# Altium schematic sheet LiPo_charger.SchDoc
size A
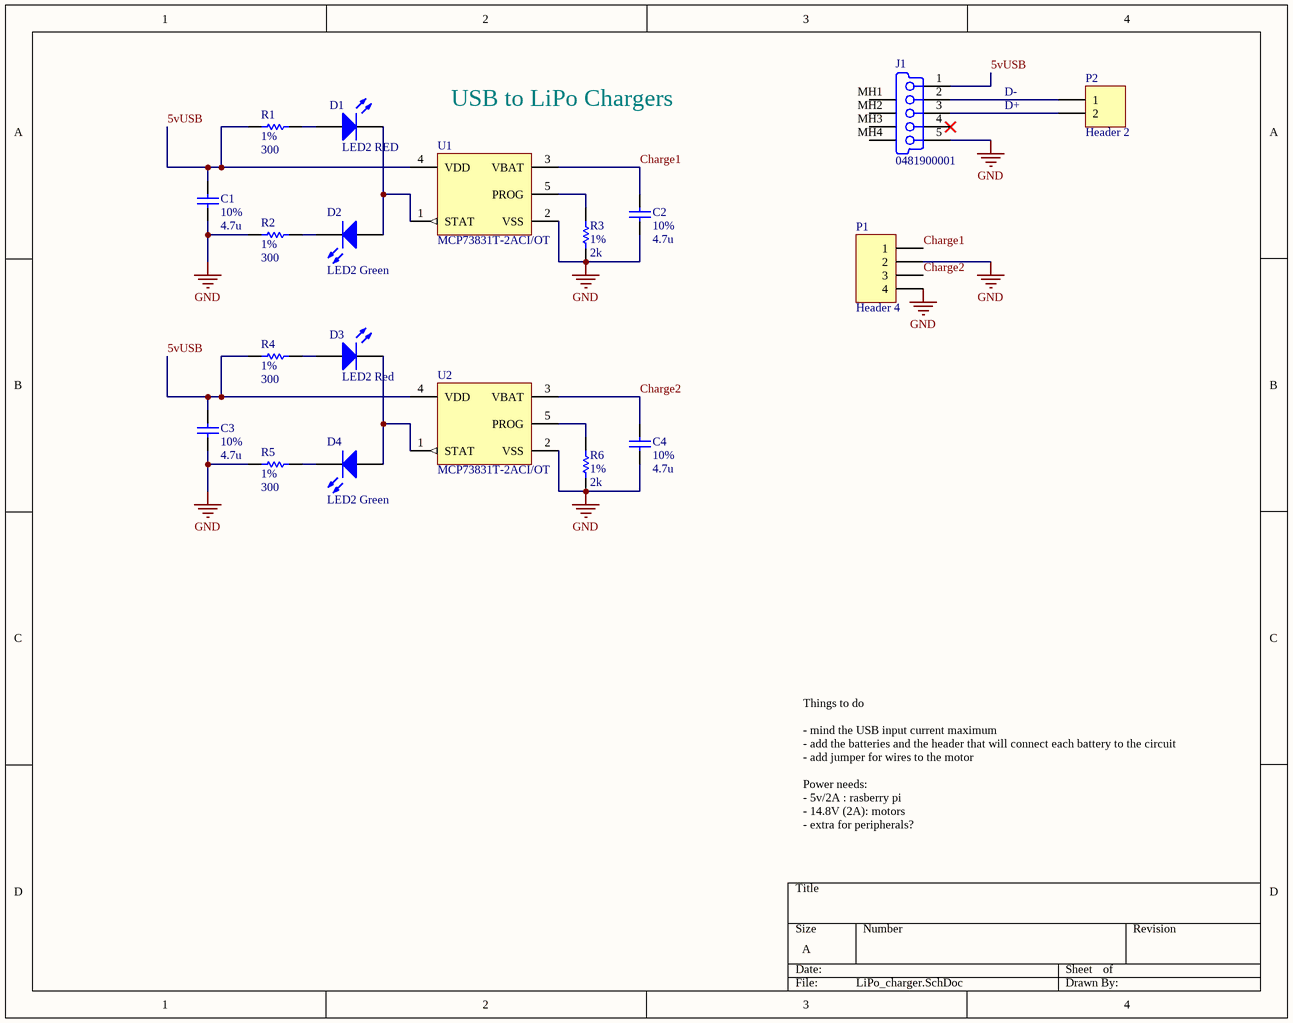
[diagram p0: LiPo_charger.SchDoc]

## Parts
C1  10%  value 4.7u  [6-0805_M]
C2  10%  value 4.7u  [6-0805_M]
C3  10%  value 4.7u  [6-0805_M]
C4  10%  value 4.7u  [6-0805_M]
D1  LED2 RED  [3.2X1.6X1.1]
D2  LED2 Green  [3.2X1.6X1.1]
D3  LED2 Red  [3.2X1.6X1.1]
D4  LED2 Green  [3.2X1.6X1.1]
J1  0481900001  [481900001]
P1  Header 4  [HDR1X4]
P2  Header 2  [HDR1X2]
R1  1%  value 300  [6-0805_M]
R2  1%  value 300  [6-0805_M]
R3  1%  value 2k  [6-0805_M]
R4  1%  value 300  [6-0805_M]
R5  1%  value 300  [6-0805_M]
R6  1%  value 2k  [6-0805_M]
U1  MCP73831T-2ACI/OT  [SOT-23-OT5_N]
U2  MCP73831T-2ACI/OT  [SOT-23-OT5_N]

## Nets
GND: C1.1 C2.1 C3.1 C4.1 J1.5(GND) P1.2 P1.4 R2.1 R3.1 R5.1 R6.1 U1.2(VSS) U2.2(VSS)
5vUSB: C1.2 C3.2 J1.1(V_BUS_(5V)) R1.1 R4.1 U1.4(VDD) U2.4(VDD)
Charge1: C2.2 P1.1 U1.3(VBAT)
Charge2: C4.2 P1.3 U2.3(VBAT)
NetD1_1: D1.1(A) R1.2
NetD1_2: D1.2(K) D2.1(A) U1.1(STAT)
NetD2_2: D2.2(K) R2.2
NetD3_1: D3.1(A) R4.2
NetD3_2: D3.2(K) D4.1(A) U2.1(STAT)
NetD4_2: D4.2(K) R5.2
NetJ1_2: J1.2(D-) P2.1
NetJ1_3: J1.3(D+) P2.2
NetR3_2: R3.2 U1.5(PROG)
NetR6_2: R6.2 U2.5(PROG)

Not connected (* = marked no-connect by the designer): J1 4(NC)* MH1(Tab) MH2(Tab) MH3(Tab) MH4(Tab)

## Notes on the sheet
- D-
- USB to LiPo Chargers
- D+
- Things to do
  - mind the USB input current maximum
  - add the batteries and the header that will connect each battery to the circuit
  - add jumper for wires to the motor
  Power needs:
  - 5v/2A : rasberry pi
  - 14.8V (2A): motors
  - extra for peripherals?

## Library data of the parts
C1-C4 = Cap: Capacitor; Published: 8-Jun-2000; LatestRevisionDate: 17-Jul-2002; LatestRevisionNote: Re-released for DXP Platform.; PackageReference: RAD-0.3; Publisher: Altium Limited; PackageDescription: Radial Cap, Thru-Hole; 2 Leads; 0.3 in Pin Spacing; Supplier 1: Digikey; Supplier Part Number 1: 478-1379-1-ND
D1 D3 = LED2: Typical RED, GREEN, YELLOW, AMBER GaAs LED; manufacture: LTST-C150CKT; Published: 8-Jun-2000; LatestRevisionDate: 17-Jul-2002; LatestRevisionNote: Re-released for DXP Platform.; PackageVersion: Feb-2002; PackageReference: 3.2X1.6X1.1; Publisher: Altium Limited; PackageDescription: SM LED; 2 Flat Leads; Supplier Part Number 1: 160-1167-1-ND
  D1: Supplier 1: digikey
  D3: Supplier Part Number 1: *; Supplier 1: Digikey
D2 D4 = LED2: Typical RED, GREEN, YELLOW, AMBER GaAs LED; manufacture: LTST-C150GKT; Published: 8-Jun-2000; LatestRevisionDate: 17-Jul-2002; LatestRevisionNote: Re-released for DXP Platform.; PackageVersion: Feb-2002; PackageReference: 3.2X1.6X1.1; Publisher: Altium Limited; PackageDescription: SM LED; 2 Flat Leads; Supplier Part Number 1: 160-1169-1-ND; Supplier 1: Digikey
J1 = 0481900001: USB On-The-Go (OTG) Mini-B Receptacle, Right Angle, SMT, 0.80mm (.031") Pitch, Solder Tabs with Back Cover, Recessed Type; PCB_Layout: Complies with Manufacturer's Recommendation.; Published: 21-Sep-2007; DatasheetVersion: revA, May-2004; PackageVersion: May-2004; PackageReference: 481900001; Publisher: Altium Limited; PackageDescription: USB Mini-B, Sinking Type, SM; 5 Position; Right Angle, Body 11.45 x 11.8 x 3.9 mm (LxWxH); ComponentLink1Description: Manufacturer Link; ComponentLink1URL: http://www.molex.com/; ComponentLink2Description: Datasheet; ComponentLink2URL: http://www.molex.com/cmc_upload/0/000/895/958/SD-48190-001RevA.pdf; Supplier Part Number 1: WM3756CT-ND; Supplier 1: Digikey
P1 = Header 4: Header, 4-Pin; LatestRevisionDate: 17-Jul-2002; LatestRevisionNote: Re-released for DXP Platform.; Publisher: Altium Limited; Supplier 1: Digikey; Supplier Part Number 1: A19431-ND
P2 = Header 2: Header, 2-Pin; LatestRevisionDate: 17-Jul-2002; LatestRevisionNote: Re-released for DXP Platform.; Publisher: Altium Limited; Supplier 1: Digikey; Supplier Part Number 1: A1921-ND
R1-R6 = Res1: Resistor; Published: 8-Jun-2000; LatestRevisionDate: 17-Jul-2002; LatestRevisionNote: Re-released for DXP Platform.; PackageReference: AXIAL-0.3; Publisher: Altium Limited; PackageDescription: Axial Device, Thru-Hole; 2 Leads; 0.3 in Pin Spacing; Supplier 1: Digikey
  R1 R2 R4 R5: Supplier Part Number 1: 311-300CRCT-ND
  R3 R6: Supplier Part Number 1: 311-2.00KCRCT-ND
U1 U2 = MCP73831T-2ACI/OT: Miniature Single-Cell, Fully Integrated Li-Ion, Li-Polymer Charge Management Controller, 4.2V, 5-Pin SOT-23, Industrial Temperature, Tape and Reel; Published: 29-Jan-2009; LatestRevisionDate: 27-Nov-2009; LatestRevisionNote: Updated to datasheet revision E, Sep-2008; DatasheetVersion: revE, Sep-2008; PackageVersion: revBB, Aug-2009; PackageReference: SOT-23-OT5; Publisher: Altium Limited; PackageDescription: 5-Lead Plastic Small Outline Transistor (OT) [SOT-23]; Supplier 1: Digi-Key; Supplier Part Number 1: MCP73831T-2ACI/OTTR-ND; Supplier 2: Digi-Key; Supplier Part Number 2: MCP73831T-2ACI/OTCT-ND; Supplier 3: Digi-Key; Supplier Part Number 3: MCP73831T-2ACI/OTDKR-ND; Supplier 4: Farnell; Supplier Part Number 4: 1332158; Code_IPC: SOT23-5; ComponentLink1Description: Datasheet; ComponentLink1URL: http://ww1.microchip.com/downloads/en/DeviceDoc/21984e.pdf; ComponentLink2Description: Packaging Specification; ComponentLink2URL: http://www.microchip.com/stellent/groups/techpub_sg/documents/packagingspec/en012702.pdf; ComponentLink3Description: Microchip.com Home; ComponentLink3URL: http://www.microchip.com/